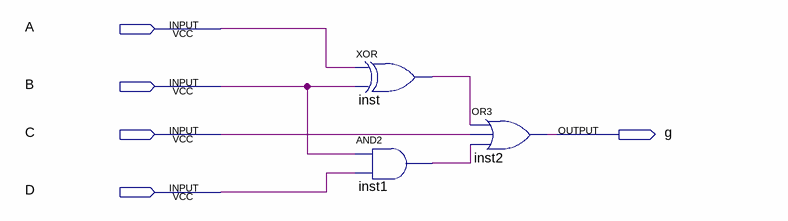
[diagram p0: schematic sheet]
// Quartus schematic output_g.bdf as structural Verilog: 3 symbols, 5 pins
module output_g (
  input  A,
  input  B,
  input  C,
  input  D,
  output g
);

  wire inst1_out, inst_out;

  xor inst (inst_out, A, B);
  and inst1 (inst1_out, B, D);
  or inst2 (g, inst_out, C, inst1_out);
endmodule
